# Altium schematic sheet LED.schdoc
size 127 x 101 mm
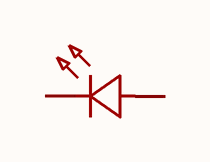
[diagram p0: LED.schdoc]

## Parts
LED?  XL-1608SURC-06  [LED0603-RD_RED]  (value not drawn)

## Nets

Not connected (* = marked no-connect by the designer): LED? 1(K) 2(A)

## Library data of the parts
LED? = XL-1608SURC-06: Manufacturer: XINGLIGHT(成兴光); Add into BOM: yes; Emitted Color: Red; Power Dissipation: 55mW; Forward Current: 25mA; Dominant Wavelength: 617nm~621nm; Peak Wavelength: 623nm; Lens Color: 无色透明透镜; Viewing Angle: 120°; Mounting Sytle: Positive post; Symbol: XL-1608SURC-06; Device: XL-1608SURC-06; LCSC Part Name: XL-1608SURC-06; Supplier Part: C965799; Manufacturer Part: XL-1608SURC-06; Supplier Footprint: 0603; JLCPCB Part Class: Extended Part; Datasheet: https://atta.szlcsc.com/upload/public/pdf/source/20221102/D860AFDD1CDB02C5A8064103A32707E2.pdf; Supplier: LCSC; Convert to PCB: yes; Color Temperature: -; Operating Temperature: -30℃~+85℃